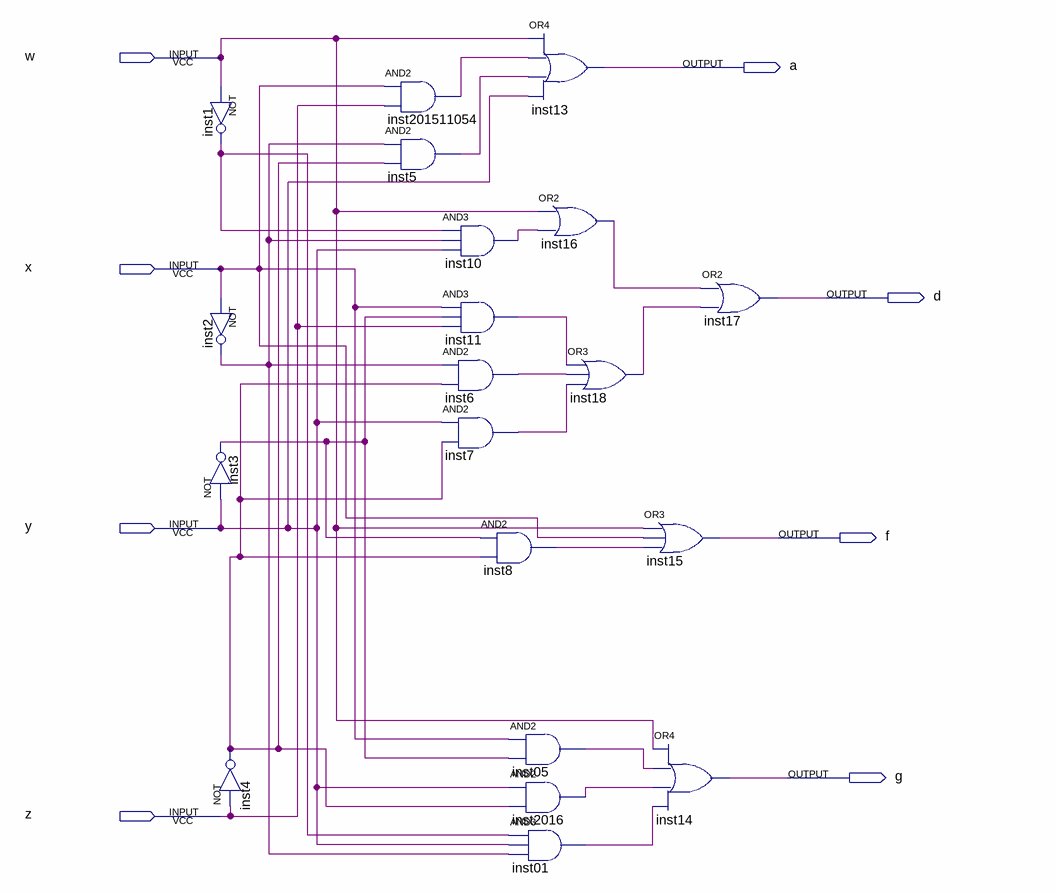
[diagram p0: schematic sheet]
// Quartus schematic lab01_2.bdf as structural Verilog: 20 symbols, 8 pins
module lab01_2 (
  input  w,
  input  x,
  input  y,
  input  z,
  output a,
  output d,
  output f,
  output g
);

  wire inst01_out, inst1_out, inst2_out, inst3_out, inst4_out, inst5_out, inst05_out, inst6_out, inst7_out,
       inst8_out, inst10_out, inst11_out, inst16_out, inst18_out, inst2016_out, inst201511054_out;

  not inst1 (inst1_out, w);
  not inst2 (inst2_out, x);
  not inst3 (inst3_out, y);
  not inst4 (inst4_out, z);
  and inst201511054 (inst201511054_out, x, z);
  and inst5 (inst5_out, inst2_out, inst4_out);
  and inst10 (inst10_out, inst1_out, inst2_out, y);
  and inst11 (inst11_out, x, inst3_out, z);
  and inst6 (inst6_out, inst2_out, inst4_out);
  and inst7 (inst7_out, y, inst4_out);
  and inst8 (inst8_out, inst3_out, inst4_out);
  or inst13 (a, w, inst201511054_out, inst5_out, y);
  or inst16 (inst16_out, w, inst10_out);
  or inst18 (inst18_out, inst11_out, inst6_out, inst7_out);
  and inst05 (inst05_out, x, inst3_out);
  and inst2016 (inst2016_out, y, inst4_out);
  and inst01 (inst01_out, inst1_out, y, inst2_out);
  or inst15 (f, w, x, inst8_out);
  or inst17 (d, inst16_out, inst18_out);
  or inst14 (g, w, inst05_out, inst2016_out, inst01_out);
endmodule
